# EasyEDA schematic SCH_My-first-PCB-hacker-card_2024-07-06.json
TITLE: Sheet_1; REV: 1.0; Date: 2024-07-06; Sheet: 1/1; Drawn By: mohittiwariis97; Company: Your Company
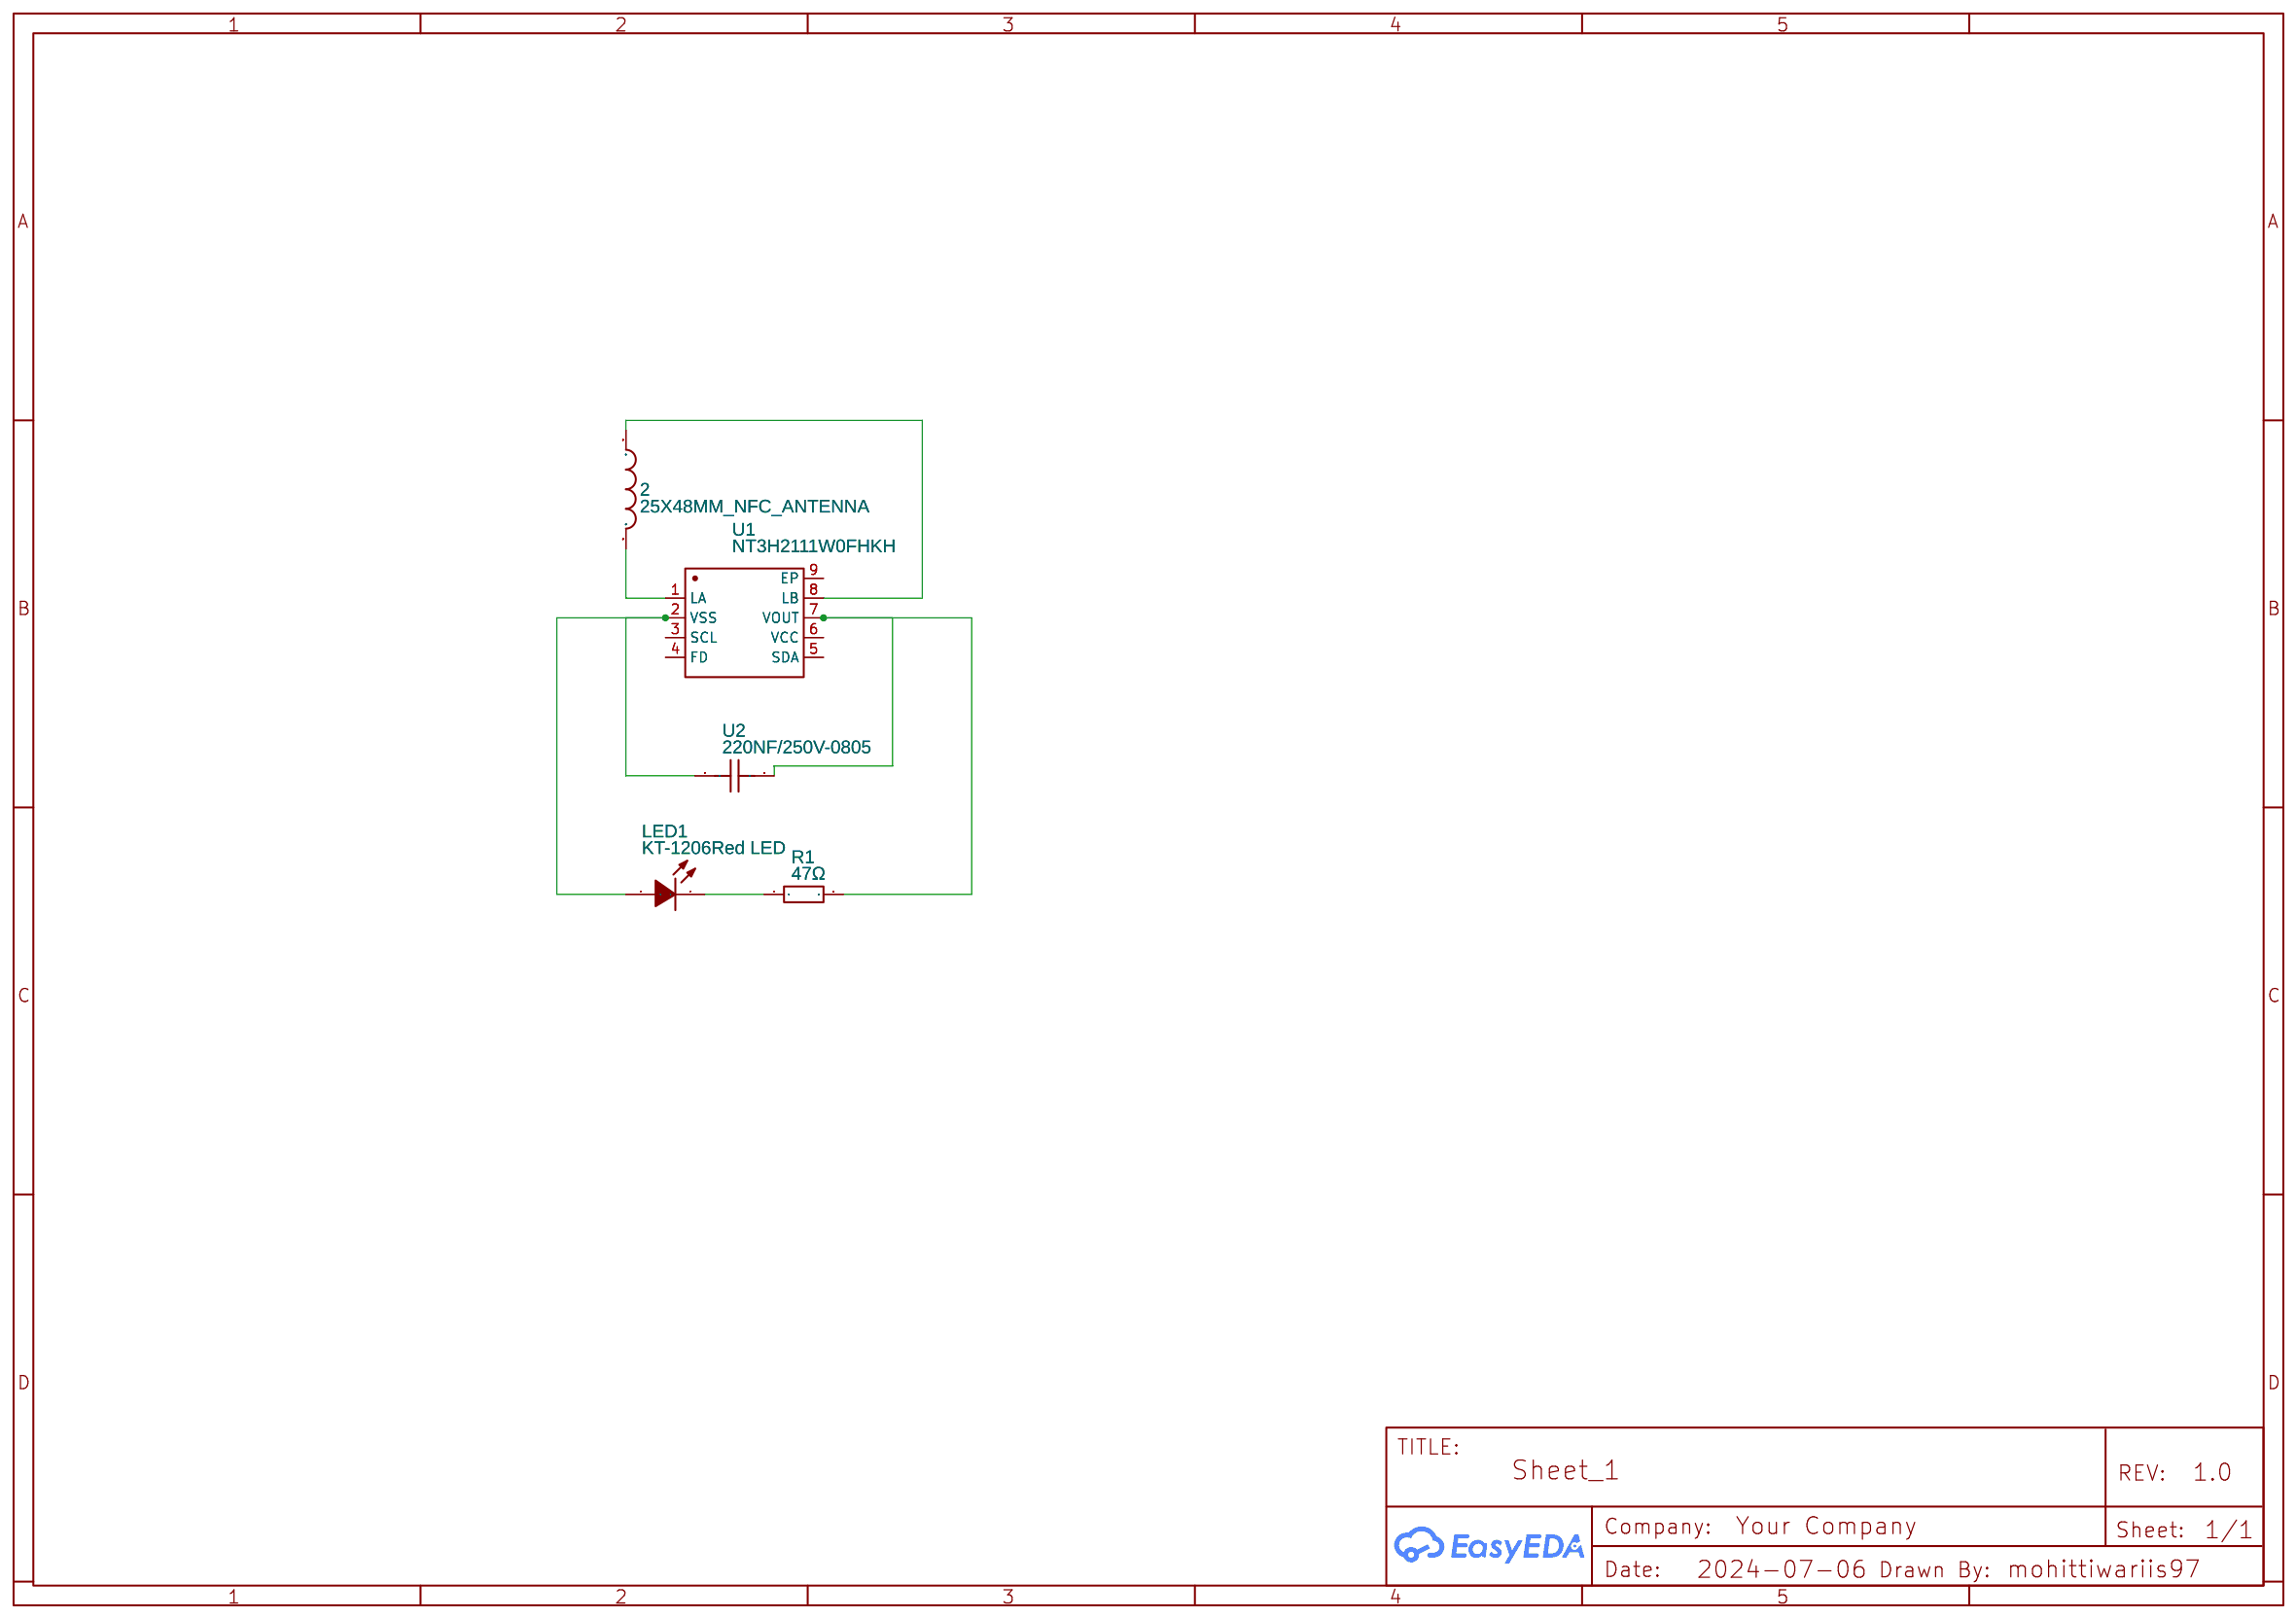
[diagram p0: schematic sheet]

## Parts
2  25X48MM_NFC_ANTENNA  [25X48MM_NFC_ANTENNA]
LED1  KT-1206Red LED  [LED-SMD_L3.2-W1.3-RD-EH2.1]
R1  47Ω  [RES-TH_BD5.5-L16.0-P20.00-D0.8]
U1  NT3H2111W0FHKH  [XQFN-8_L1.6-W1.6-P0.50-BL]
U2  220NF/250V-0805  [C0805]

## Library data of the parts
2 = 25X48MM_NFC_ANTENNA: Contributor: dnonoo
LED1 = KT-1206Red LED: Supplier: LCSC; Manufacturer: KENTO; Manufacturer Part: KT-1206R; Supplier Part: C49018; JLCPCB Part Class: Extended Part
R1 = 47Ω(470) ±5%: Contributor: LCSC; Supplier: LCSC; Supplier Part: C209824; Manufacturer: CCO(千志电子); Manufacturer Part: KNP2W-47Ω±5% MK型; JLCPCB Part Class: Extended Part
U1 = NT3H2111W0FHKH: Contributor: LCSC; Supplier: LCSC; Supplier Part: C710403; Manufacturer: NXP(恩智浦); JLCPCB Part Class: Extended Part
U2 = 220NF/250V-0805: Contributor: LCSC; Supplier: LCSC; Supplier Part: C9900007257; Manufacturer: null; Manufacturer Part: 220nF/250V-0805; JLCPCB Part Class: Extended Part

## Nets
Net-(2-P$1): 2.P$1 U1.8(LB)
Net-(2-P$2): 2.P$2 U1.1(LA)
Net-(LED1-1): LED1.1(A) U1.2(VSS) U2.1
Net-(LED1-2): LED1.2(K) R1.1
Net-(R1-2): R1.2 U1.7(VOUT) U2.2

Not connected (* = marked no-connect by the designer): U1 3(SCL) 4(FD) 5(SDA) 6(VCC) 9(EP)
